# EAGLE schematic raspberry_aux_board (EAGLE 9.3.2)
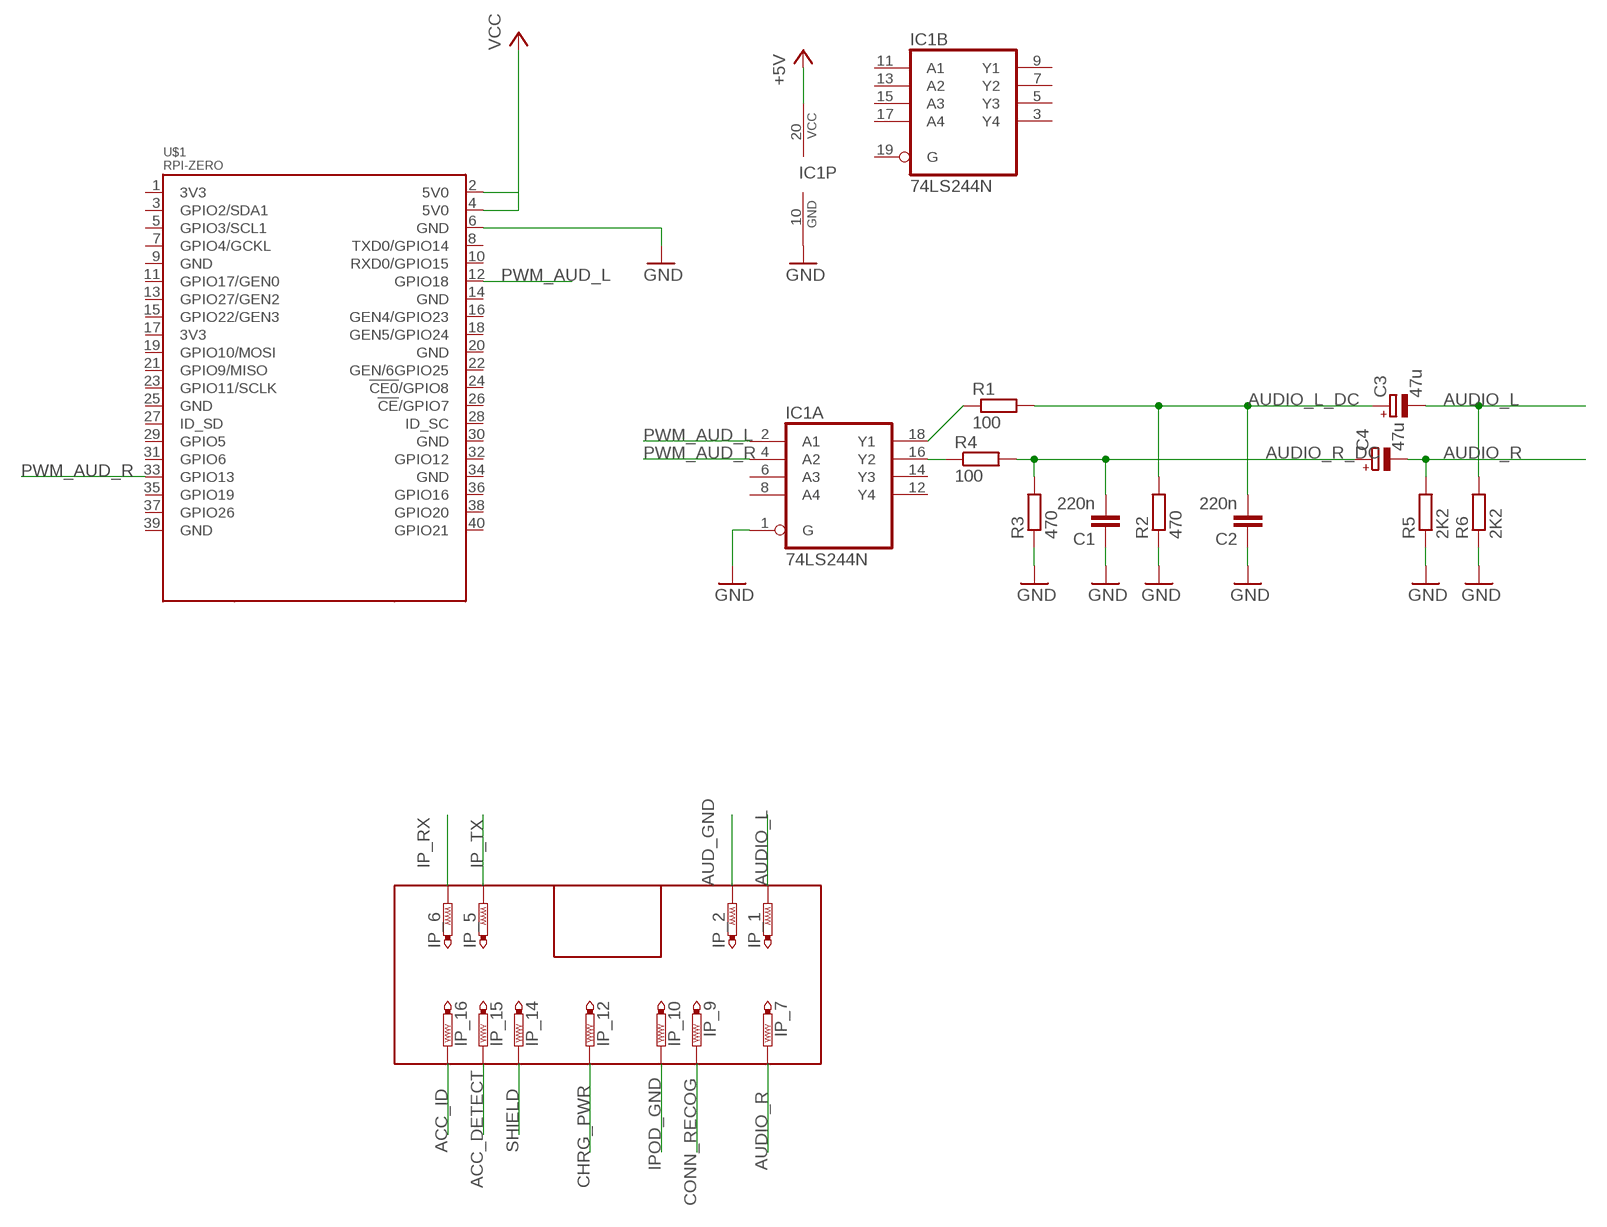
[diagram p0: schematic, sheet 1]

## Parts
C1  220n  C-EU025_050-035X075  [C025_050-035X075]
C2  220n  C-EU025_050-035X075  [C025_050-035X075]
C3  47u  CPOL-EUE2.5-5  [E2,5-5]
C4  47u  CPOL-EUE2.5-5  [E2,5-5]
IC1  74LS244N  [DIL20]
IP_1  PTR1PAD1-17  [P1-17]
IP_2  PTR1PAD1-17  [P1-17]
IP_5  PTR1PAD1-17  [P1-17]
IP_6  PTR1PAD1-17  [P1-17]
IP_7  PTR1PAD1-17  [P1-17]
IP_9  PTR1PAD1-17  [P1-17]
IP_10  PTR1PAD1-17  [P1-17]
IP_12  PTR1PAD1-17  [P1-17]
IP_14  PTR1PAD1-17  [P1-17]
IP_15  PTR1PAD1-17  [P1-17]
IP_16  PTR1PAD1-17  [P1-17]
R1  100  R-EU_0207/10  [0207/10]
R2  470  R-EU_0207/10  [0207/10]
R3  470  R-EU_0207/10  [0207/10]
R4  100  R-EU_0207/10  [0207/10]
R5  2K2  R-EU_0207/10  [0207/10]
R6  2K2  R-EU_0207/10  [0207/10]
U$1  RPI-ZERO  [RASPBERRYPI_BASTELSTUBE_V13_RASPI_BOARD_B+_FULL]

## Nets
+5V: IC1.20(P:VCC)
ACC_DETECT: IP_15.TP
ACC_ID: IP_16.TP
AUD_GND: IP_2.TP
AUDIO_L: C3.- IP_1.TP R6.2
AUDIO_L_DC: C2.2 C3.+ R1.2 R2.2
AUDIO_R: C4.- IP_7.TP R5.2
AUDIO_R_DC: C1.2 C4.+ R3.2 R4.2
CHRG_PWR: IP_12.TP
CONN_RECOG: IP_9.TP
GND: C1.1 C2.1 IC1.1(A:G) IC1.10(P:GND) R2.1 R3.1 R5.1 R6.1 U$1.6(GND)
IP_RX: IP_6.TP
IP_TX: IP_5.TP
IPOD_GND: IP_10.TP
N$1: IC1.18(A:Y1) R1.1
N$3: IC1.16(A:Y2) R4.1
PWM_AUD_L: IC1.2(A:A1) U$1.12(GPIO18)
PWM_AUD_R: IC1.4(A:A2) U$1.33(GPIO13)
SHIELD: IP_14.TP
VCC: U$1.2(5V0) U$1.4(5V0)
Unconnected: IC1.3(B:Y4) IC1.5(B:Y3) IC1.6(A:A3) IC1.7(B:Y2) IC1.8(A:A4) IC1.9(B:Y1) IC1.11(B:A1) IC1.12(A:Y4) IC1.13(B:A2) IC1.14(A:Y3) IC1.15(B:A3) IC1.17(B:A4) IC1.19(B:G) U$1.1(3V3) U$1.3(GPIO2/SDA1) U$1.5(GPIO3/SCL1) U$1.7(GPIO4/GCKL) U$1.8(TXD0/GPIO14) U$1.9(GND) U$1.10(RXD0/GPIO15) U$1.11(GPIO17/GEN0) U$1.13(GPIO27/GEN2) U$1.14(GND) U$1.15(GPIO22/GEN3) U$1.16(GEN4/GPIO23) U$1.17(3V3) U$1.18(GEN5/GPIO24) U$1.19(GPIO10/MOSI) U$1.20(GND) U$1.21(GPIO9/MISO) U$1.22(GEN/6GPIO25) U$1.23(GPIO11/SCLK) U$1.24(!CE0!/GPIO8) U$1.25(GND) U$1.26(!CE!/GPIO7) U$1.27(ID_SD) U$1.28(ID_SC) U$1.29(GPIO5) U$1.30(GND) U$1.31(GPIO6) U$1.32(GPIO12) U$1.34(GND) U$1.35(GPIO19) U$1.36(GPIO16) U$1.37(GPIO26) U$1.38(GPIO20) U$1.39(GND) U$1.40(GPIO21)

## Library data of the parts
C1 C2 = rcl:C-EU: CAPACITOR, European symbol; SPICEPREFIX: C
C3 C4 = rcl:CPOL-EU: POLARIZED CAPACITOR, European symbol; SPICEPREFIX: C
IC1 = 74xx-us:74*244: Octal BUFFER and LINE DRIVER, 3-state
IP_1 IP_2 IP_5-IP_7 IP_9 IP_10 IP_12 IP_14-IP_16 = testpad:PTR1: TEST PIN
R1-R6 = rcl:R-EU_: RESISTOR, European symbol; SPICEPREFIX: R
U$1 = RPI-Zero:RPI-ZERO